# Altium schematic sheet AT89S52多功能板3.SchDoc
size A4
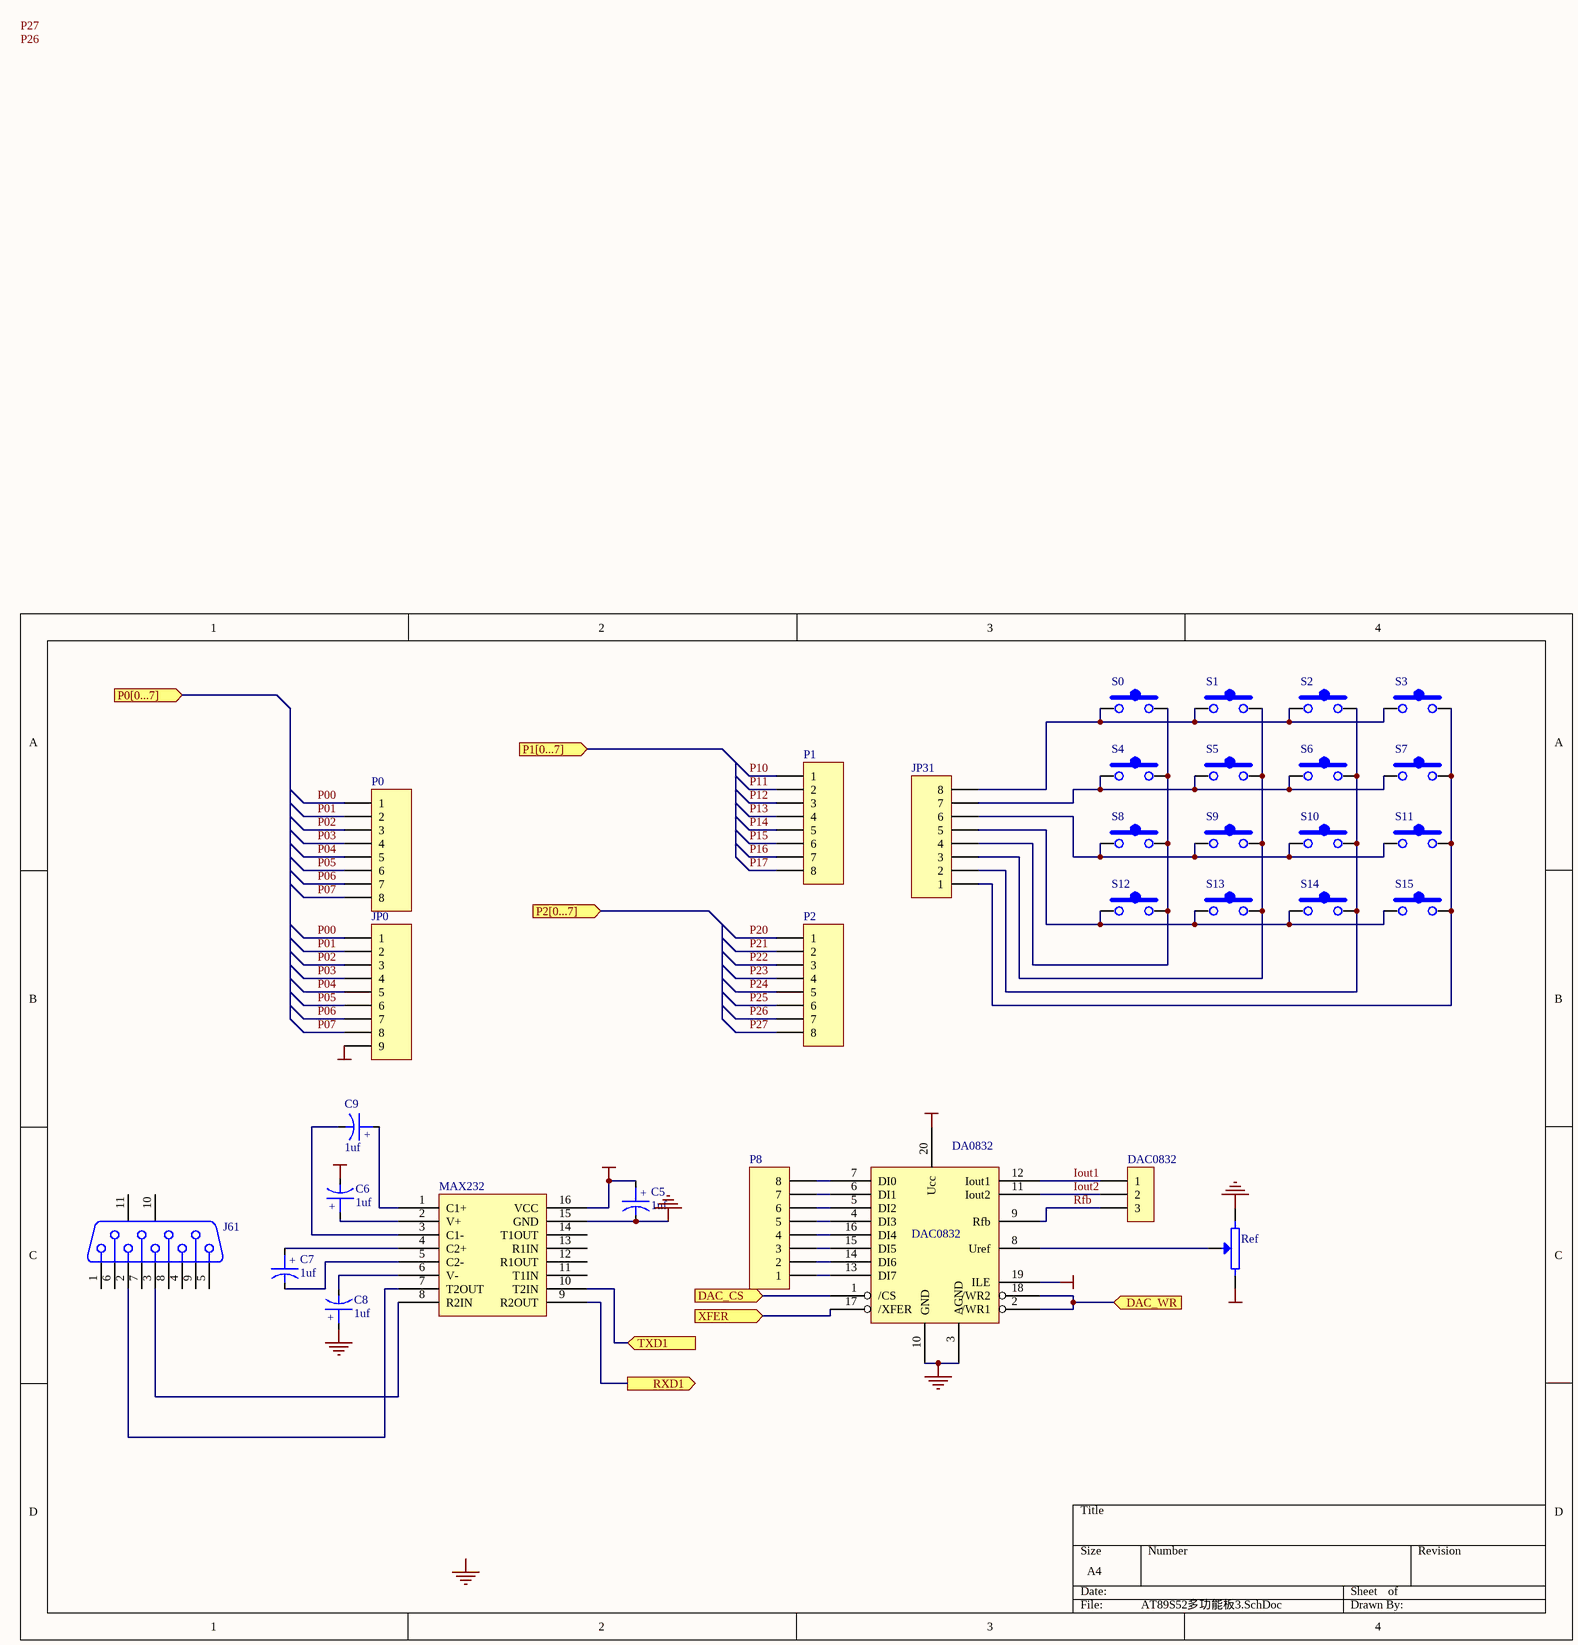
[diagram p0: AT89S52多功能板3.SchDoc]

## Parts
C5  1uf  [cap2]
C6  1uf  [cap2]
C7  1uf  [cap2]
C8  1uf  [cap2]
C9  1uf  [cap2]
DA0832  DA0832  [DAC0832PF]  (value not drawn)
DAC0832  CON3  [HDR1X3]  (value not drawn)
J61  D Connector 9  [DSUB1.385-2H9]  (value not drawn)
JP0  Header 9  [HDR1X9]  (value not drawn)
JP31  Header 8  [HDR1X8]  (value not drawn)
MAX232  MAX232  [DIP16]  (value not drawn)
P0  Header 8  [HDR1X8]  (value not drawn)
P1  Header 8  [HDR1X8]  (value not drawn)
P2  Header 8  [HDR1X8]  (value not drawn)
P8  Header 8  [HDR1X8]  (value not drawn)
Ref  25k  [SIP3-D]  (value not drawn)
S0  KEY  [KEYPF]  (value not drawn)
S1  KEY  [KEYPF]  (value not drawn)
S2  KEY  [KEYPF]  (value not drawn)
S3  KEY  [KEYPF]  (value not drawn)
S4  KEY  [KEYPF]  (value not drawn)
S5  KEY  [KEYPF]  (value not drawn)
S6  KEY  [KEYPF]  (value not drawn)
S7  KEY  [KEYPF]  (value not drawn)
S8  KEY  [KEYPF]  (value not drawn)
S9  KEY  [KEYPF]  (value not drawn)
S10  KEY  [KEYPF]  (value not drawn)
S11  KEY  [KEYPF]  (value not drawn)
S12  KEY  [KEYPF]  (value not drawn)
S13  KEY  [KEYPF]  (value not drawn)
S14  KEY  [KEYPF]  (value not drawn)
S15  KEY  [KEYPF]  (value not drawn)

## Ports
DAC_CS (in), DAC_WR (in), P0[0...7] (in), P1[0...7] (in), P2[0...7] (in), RXD1 (out), TXD1 (in), XFER (in)

## Nets
GND: C5.2 C8.1 DA0832.3(AGND) DA0832.10(GND) MAX232.15(GND) Ref.2
VCC: C5.1 C6.2 DA0832.19(ILE) DA0832.20(Ucc) JP0.9 MAX232.16(VCC) Ref.1
DAC_CS: DA0832.1(/CS) ; port DAC_CS
DAC_WR: DA0832.2(/WR1) DA0832.18(/WR2) ; port DAC_WR
Iout1: DA0832.12(Iout1) DAC0832.1
Iout2: DA0832.11(Iout2) DAC0832.2
P00: JP0.1 P0.1
P01: JP0.2 P0.2
P02: JP0.3 P0.3
P03: JP0.4 P0.4
P04: JP0.5 P0.5
P05: JP0.6 P0.6
P06: JP0.7 P0.7
P07: JP0.8 P0.8
P10: P1.1
P11: P1.2
P12: P1.3
P13: P1.4
P14: P1.5
P15: P1.6
P16: P1.7
P17: P1.8
P20: P2.1
P21: P2.2
P22: P2.3
P23: P2.4
P24: P2.5
P25: P2.6
P26: P2.7
P27: P2.8
Rfb: DA0832.9(Rfb) DAC0832.3
RXD1: MAX232.9(R2OUT) ; port RXD1
TXD1: MAX232.10(T2IN) ; port TXD1
XFER: DA0832.17(/XFER) ; port XFER
NetC6_1: C6.1 MAX232.2(V+)
NetC7_1: C7.1 MAX232.4(C2+)
NetC7_2: C7.2 MAX232.5(C2-)
NetC8_2: C8.2 MAX232.6(V-)
NetC9_1: C9.1 MAX232.1(C1+)
NetC9_2: C9.2 MAX232.3(C1-)
NetDA0832_4: DA0832.4(DI3) P8.5
NetDA0832_5: DA0832.5(DI2) P8.6
NetDA0832_6: DA0832.6(DI1) P8.7
NetDA0832_7: DA0832.7(DI0) P8.8
NetDA0832_8: DA0832.8(Uref) Ref.3(W)
NetDA0832_13: DA0832.13(DI7) P8.1
NetDA0832_14: DA0832.14(DI6) P8.2
NetDA0832_15: DA0832.15(DI5) P8.3
NetDA0832_16: DA0832.16(DI4) P8.4
NetJ61_2: J61.2 MAX232.7(T2OUT)
NetJ61_3: J61.3 MAX232.8(R2IN)
NetJP31_1: JP31.1 S3.2 S7.2 S11.2 S15.2
NetJP31_2: JP31.2 S2.2 S6.2 S10.2 S14.2
NetJP31_3: JP31.3 S1.2 S5.2 S9.2 S13.2
NetJP31_4: JP31.4 S0.2 S4.2 S8.2 S12.2
NetJP31_5: JP31.5 S12.1 S13.1 S14.1 S15.1
NetJP31_6: JP31.6 S8.1 S9.1 S10.1 S11.1
NetJP31_7: JP31.7 S4.1 S5.1 S6.1 S7.1
NetJP31_8: JP31.8 S0.1 S1.1 S2.1 S3.1

Not connected (* = marked no-connect by the designer): J61 1 4 5 6 7 8 9 10(MH1) 11(MH2); MAX232 11(T1IN) 12(R1OUT) 13(R1IN) 14(T1OUT)

## Notes on the sheet
- Labels drawn without touching a wire or pin: GND, P26, P27
- (in symbol CAPACITOR POL) +
- (in symbol DA0832) DAC0832

## Library data of the parts
C5-C9 = CAPACITOR POL: Capacitor
DAC0832 = CON3: Connector
J61 = D Connector 9: Receptacle Assembly, 9 Position, Right Angle; Package Information: Latest Revision: O; Positions: 9; Published: 15-Jun-2001; Revision: 17-Jul-2002: Re-released for DXP Platform.; Datasheet: (1-Sep-1999); Package Reference: 788750; Publisher: Altium Limited; Orientation: Right Angle; Gender: Receptacle
JP0 = Header 9: Header, 9-Pin; Revision: 17-Jul-2002: Re-released for DXP Platform.; Publisher: Altium Limited
JP31 P0-P2 P8 = Header 8: Header, 8-Pin; Revision: 17-Jul-2002: Re-released for DXP Platform.; Publisher: Altium Limited
Ref = POT2: Potentiometer